# Altium schematic sheet CPU_Logic.SchDoc: Title
size A4; Date: Date; CompanyName: Integrated Micro-Electronics Bulgaria; Organization: Design & Development Department; Address1: Drawing Type; Address2: Address 1; Address3: Address 2; Address4: Address 3; DocumentNumber: 730xxx; Revision: 01; SheetNumber: 1; SheetTotal: 1; PageSetup: Record=PageOptions|CenterHorizontal=True|CenterVertical=True|PrintScale=0.70|XCorrection=1.00|YCorrection=1.00|PrintKind=2|BorderSize=5000000|LeftOffset=0|BottomOffset=0|Orientation=2|PaperLength=1000|PaperWidth=1000|Scale=100|PaperSource=7|PrintQuality=-4|MediaType=1|DitherType=10|PaperKind=A4|PrintScaleMode=1; SheetSize: A3; Time: Time; ModifiedDate: Mod. Date
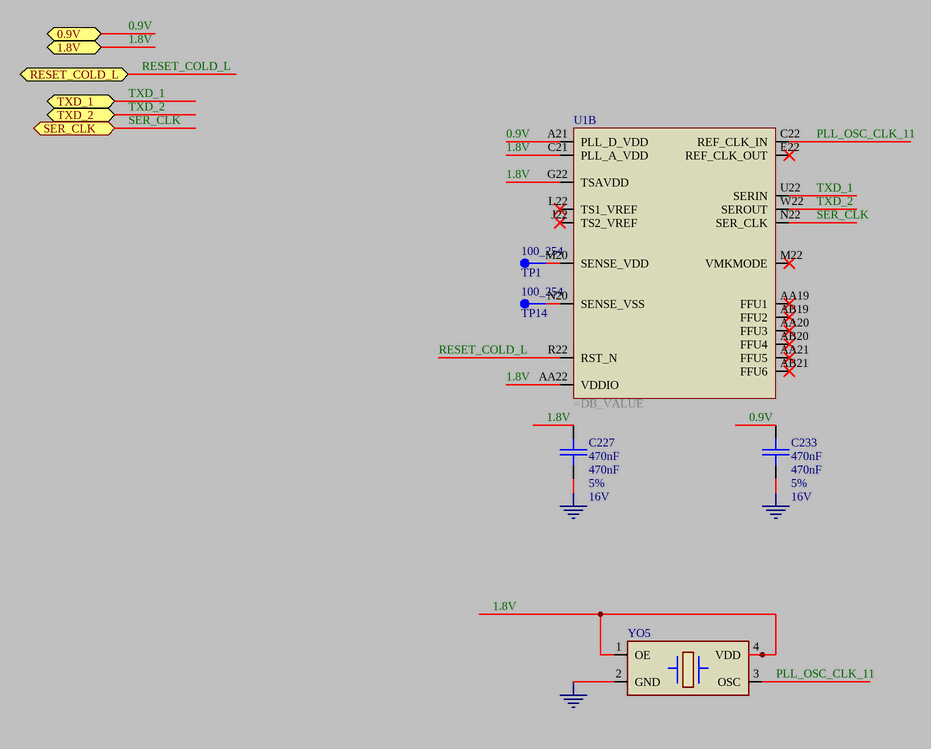
[diagram p0: CPU_Logic.SchDoc]

## Parts
C227  470nF  DB_TOLERANCE: 5%  DB_VOLTAGE: 16V  [SMD_0603_CAPC1608X95N]
C233  470nF  DB_TOLERANCE: 5%  DB_VOLTAGE: 16V  [SMD_0603_CAPC1608X95N]
TP1  100_254  [SMD_TP_100-254]
TP14  100_254  [SMD_TP_100-254]
U1  (no value)  [SMD_BGA480C80P22X22]  (part B of 2)
YO5  (no value)  [SMD_OSCCF250X320X90-4N]

## Ports
0.9V, 1.8V, RESET_COLD_L, SER_CLK, TXD_1, TXD_2

## Nets
GND: C227.1 C233.1 YO5.2(GND)
0.9V: C233.2 U1.A21(PLL_D_VDD) ; port 0.9V
1.8V: C227.2 U1.AA22(VDDIO) U1.C21(PLL_A_VDD) U1.G22(TSAVDD) YO5.1(OE) YO5.4(VDD) ; port 1.8V
PLL_OSC_CLK_11: U1.C22(REF_CLK_IN) YO5.3(OSC)
RESET_COLD_L: U1.R22(RST_N) ; port RESET_COLD_L
SER_CLK: U1.N22(SER_CLK) ; port SER_CLK
TXD_1: U1.U22(SERIN) ; port TXD_1
TXD_2: U1.W22(SEROUT) ; port TXD_2
NetTP1_1: TP1.1 U1.M20(SENSE_VDD)
NetTP14_1: TP14.1 U1.N20(SENSE_VSS)

Not connected (* = marked no-connect by the designer): U1 AA19(FFU1)* AA20(FFU3)* AA21(FFU5)* AB19(FFU2)* AB20(FFU4)* AB21(FFU6)* E22(REF_CLK_OUT)* J22(TS2_VREF)* L22(TS1_VREF)* M22(VMKMODE)*

## Library data of the parts
C227 C233 = CAP000028169: DB_PART_TYPE: Ceramic_SMD\Standard_X7R; DB_MANUFACTURER_PART: KEMET    C0603C474J4RAC; NOTE: <NOTE>; DB_T_RANGE: -55 to 125; DB_PACKAGE: 0603; DB_DESCRIPTION: C X7R 470nF 5% 16V 0603; DB_CERTIFIED: ISHIDDEN=T; DB_APPROVED_ON: 09.10.2010 г.; DB_STATUS: NEW; DB_PART_NUMBER: CAP000028169; DB_VALUE: 470nF; DB_PCB_DEVICE: SMD_0603_CAPC1608X95N; DB_PRICE: ISHIDDEN=T; DB_LEADTIME: ISHIDDEN=T; DB_MOQ: ISHIDDEN=T; DB_PRICE_DATE: ISHIDDEN=T; DB_APPROVED_BY: ISHIDDEN=T; DB_DATASHEET: http://john.epiqdesign.com/projects/CIS_Datasheets/F3102_CE_Kemet.pdf?rev=92&sc=0
TP1 TP14 = TPO000000001: DB_PART_TYPE: Test Point; DB_PACKAGE: ISHIDDEN=T; DB_DESCRIPTION: Test Point 100_254; DB_APPROVED_ON: 10.9.2010 г.; DB_STATUS: NEW; DB_PART_NUMBER: TPO000000001; DB_VALUE: 100_254; DB_DIAMETER: 100_254; DB_PCB_DEVICE: SMD_TP_100-254; DB_MANUFACTURER_PART: ISHIDDEN=T; DB_CERTIFIED: ISHIDDEN=T; DB_PRICE: ISHIDDEN=T; DB_LEADTIME: ISHIDDEN=T; DB_MOQ: ISHIDDEN=T; DB_PRICE_DATE: ISHIDDEN=T; DB_APPROVED_BY: ISHIDDEN=T; DB_DATASHEET: ISHIDDEN=T
U1 = IC_RockerBox: DB_PCB_DEVICE: SMD_BGA480C80P22X22
YO5 = XTAL_OE1GND2OSC3VDD4: NOTE: <NOTE>; DB_PCB_DEVICE: SMD_OSCCF250X320X90-4N